# EAGLE design Layout_Stecksockel (EAGLE 7.2.0)
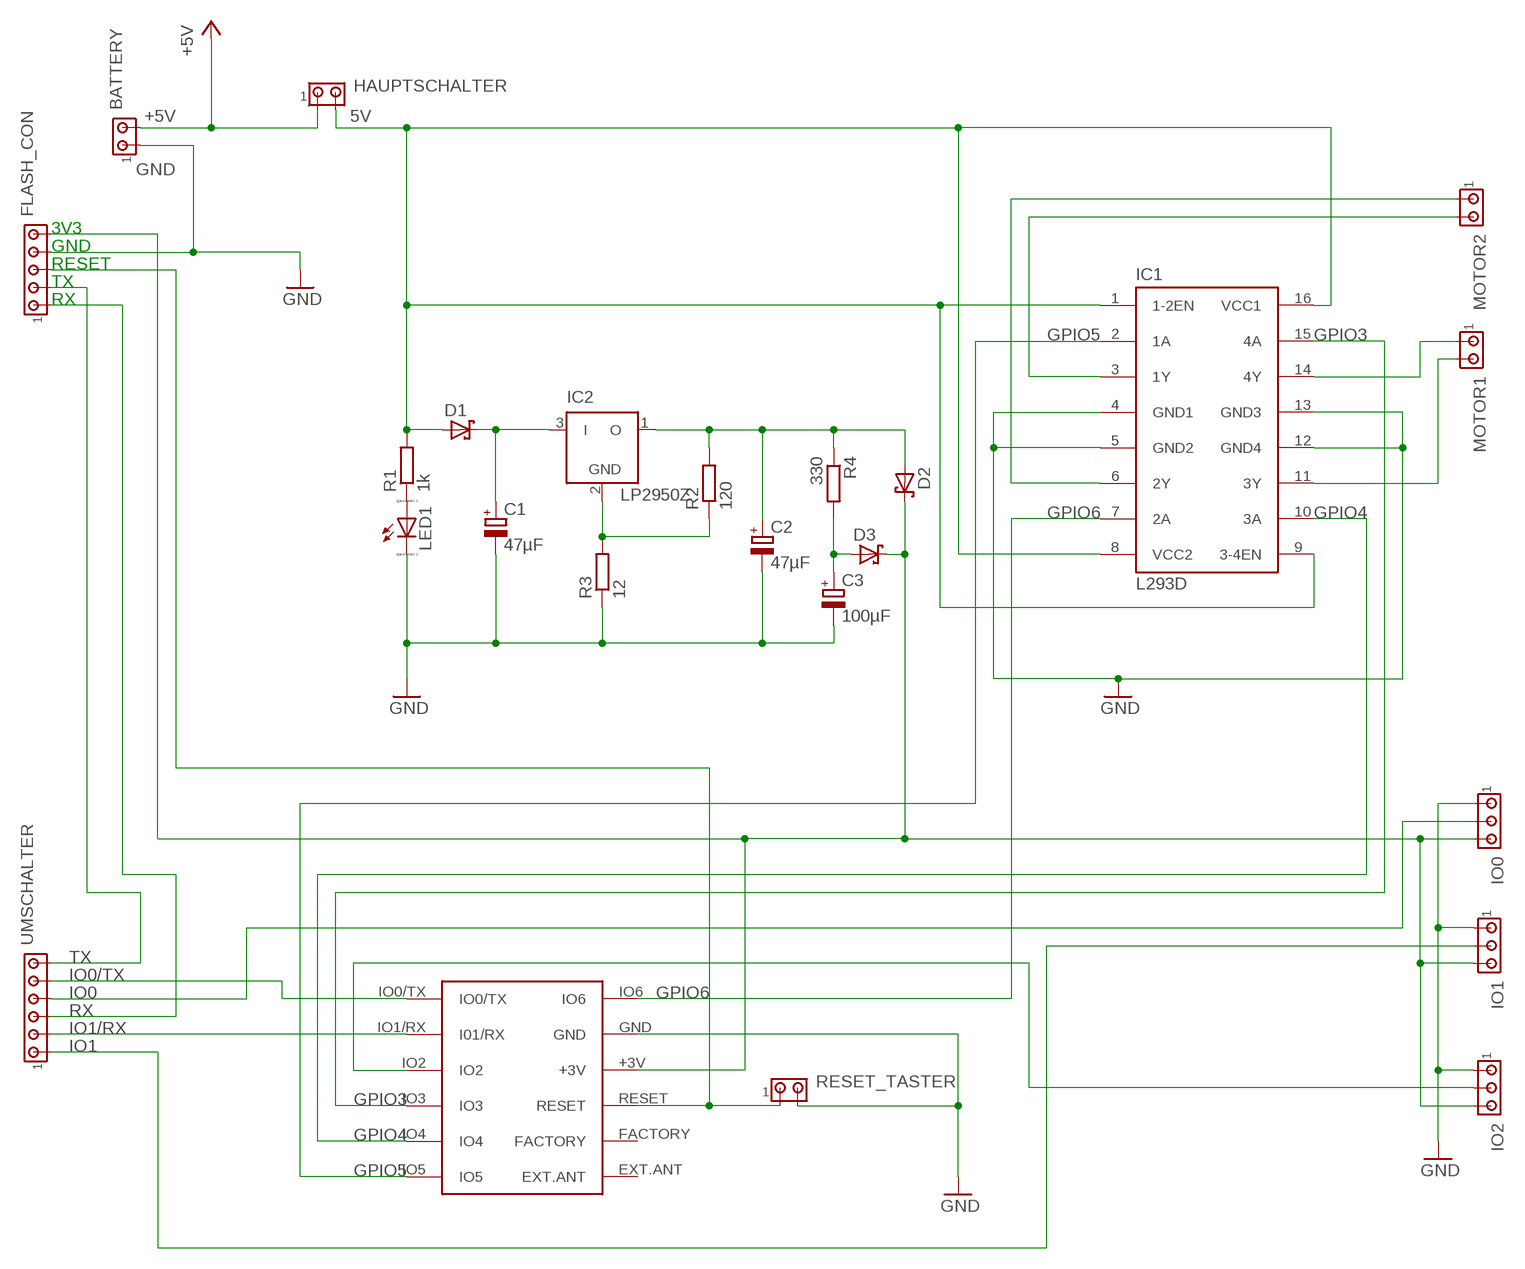
[diagram p0: schematic, sheet 1]

## Parts
BATTERY  MTA02-100  [10X02MTA]
C1  47µF  CPOL-EUE2,5-6E  [E2,5-6E]
C2  47µF  CPOL-EUE2,5-6E  [E2,5-6E]
C3  100µF  CPOL-EUE2,5-6E  [E2,5-6E]
D1  SCHOTTKY-DIODEDO35-7  [DO35-7]
D2  SCHOTTKY-DIODEDO35-7  [DO35-7]
D3  SCHOTTKY-DIODEDO35-7  [DO35-7]
FLASH_CON  MTA05-100  [10X05MTA]
HAUPTSCHALTER  MTA02-100  [10X02MTA]
IC1  L293D  [DIL16]
IC2  LP2950Z  [TO92]
IO0  MTA03-100  [10X03MTA]
IO1  MTA03-100  [10X03MTA]
IO2  MTA03-100  [10X03MTA]
LED1  LED_ELD260  [LED_LD260]
MOTOR1  MTA02-100  [10X02MTA]
MOTOR2  MTA02-100  [10X02MTA]
R1  1k  R-EU_0207/10  [0207/10]
R2  120  R-EU_0207/10  [0207/10]
R3  12  R-EU_0207/10  [0207/10]
R4  330  R-EU_0207/10  [0207/10]
RESET_TASTER  MTA02-100  [10X02MTA]
U$1  RFDUINO  [RFDUINO]
UMSCHALTER  MTA06-100  [10X06MTA]

## Nets
5V: D1.A HAUPTSCHALTER.2 IC1.1(1-2EN) IC1.8(VCC2) IC1.9(3-4EN) IC1.16(VCC1) R1.2
+3V: D2.C D3.C FLASH_CON.5 IO0.3 IO1.3 IO2.3 U$1.+3V
+5V: BATTERY.2 HAUPTSCHALTER.1
GND: BATTERY.1 C1.- C2.- C3.- FLASH_CON.4 IC1.4(GND1) IC1.5(GND2) IC1.12(GND4) IC1.13(GND3) IO0.1 IO1.1 IO2.1 LED1.K(C) R3.1 RESET_TASTER.2 U$1.GND
GPIO3: IC1.15(4A) U$1.IO3
GPIO4: IC1.10(3A) U$1.IO4
GPIO5: IC1.2(1A) U$1.IO5
GPIO6: IC1.7(2A) U$1.IO6
IO0: IO0.2 UMSCHALTER.4
IO0/TX: U$1.IO0/TX UMSCHALTER.5
IO1: IO1.2 UMSCHALTER.1
IO1/RX: U$1.IO1/RX(I01/RX) UMSCHALTER.2
N$1: C1.+ D1.C IC2.3(I)
N$2: C3.+ D3.A R4.2
N$5: LED1.A R1.1
N$7: IC1.6(2Y) MOTOR2.1
N$9: IC1.3(1Y) MOTOR2.2
N$10: IC2.2(GND) R2.1 R3.2
N$11: IC1.11(3Y) MOTOR1.2
N$12: IC1.14(4Y) MOTOR1.1
N$15: FLASH_CON.3 RESET_TASTER.1 U$1.RESET
N$17: C2.+ D2.A IC2.1(O) R2.2 R4.1
N$20: IO2.2 U$1.IO2
RX: FLASH_CON.1 UMSCHALTER.3
TX: FLASH_CON.2 UMSCHALTER.6
Unconnected: U$1.EXT.ANT U$1.FACTORY

## Notes on the sheet
- 3V3
- GND
- RESET
- TX
- RX

## Library data of the parts
BATTERY HAUPTSCHALTER MOTOR1 MOTOR2 RESET_TASTER = con-amp:MTA02-100: AMP connector
C1-C3 = rcl:CPOL-EU: POLARIZED CAPACITOR, European symbol
D1-D3 = diode:SCHOTTKY-DIODE: Schottky Diode
FLASH_CON = con-amp:MTA05-100: AMP connector
IC1 = st-microelectronics:L293D: PUSH-PULL 4 CHANNEL DRIVER; MPN: L293D; OC_FARNELL: 9589619; OC_NEWARK: 56P8249
IC2 = linear:LP2950: 100 mA, Low Power Low Dropout Voltage Regulator Source: http://www.onsemi.com/pub/Collateral/LP2950-D.PDF
IO0 IO1 IO2 = con-amp:MTA03-100: AMP connector
LED1 = eagle-ltspice:LED_E: LED Source: http://www.osram.convergy.de Source: www.luxeon.com Source: www.kingbright.com; SPICEMODEL: NONE; SPICEPREFIX: D; SPICETYPE: diode
R1 = resistor:R-EU_: RESISTOR, European symbol
R2-R4 = rcl:R-EU_: RESISTOR, European symbol
U$1 = RFDuino:RFDUINO
UMSCHALTER = con-amp:MTA06-100: AMP connector Connection corrected 2014-09-19

## Net classes
0 default: clearance 0.205 mm

## Board
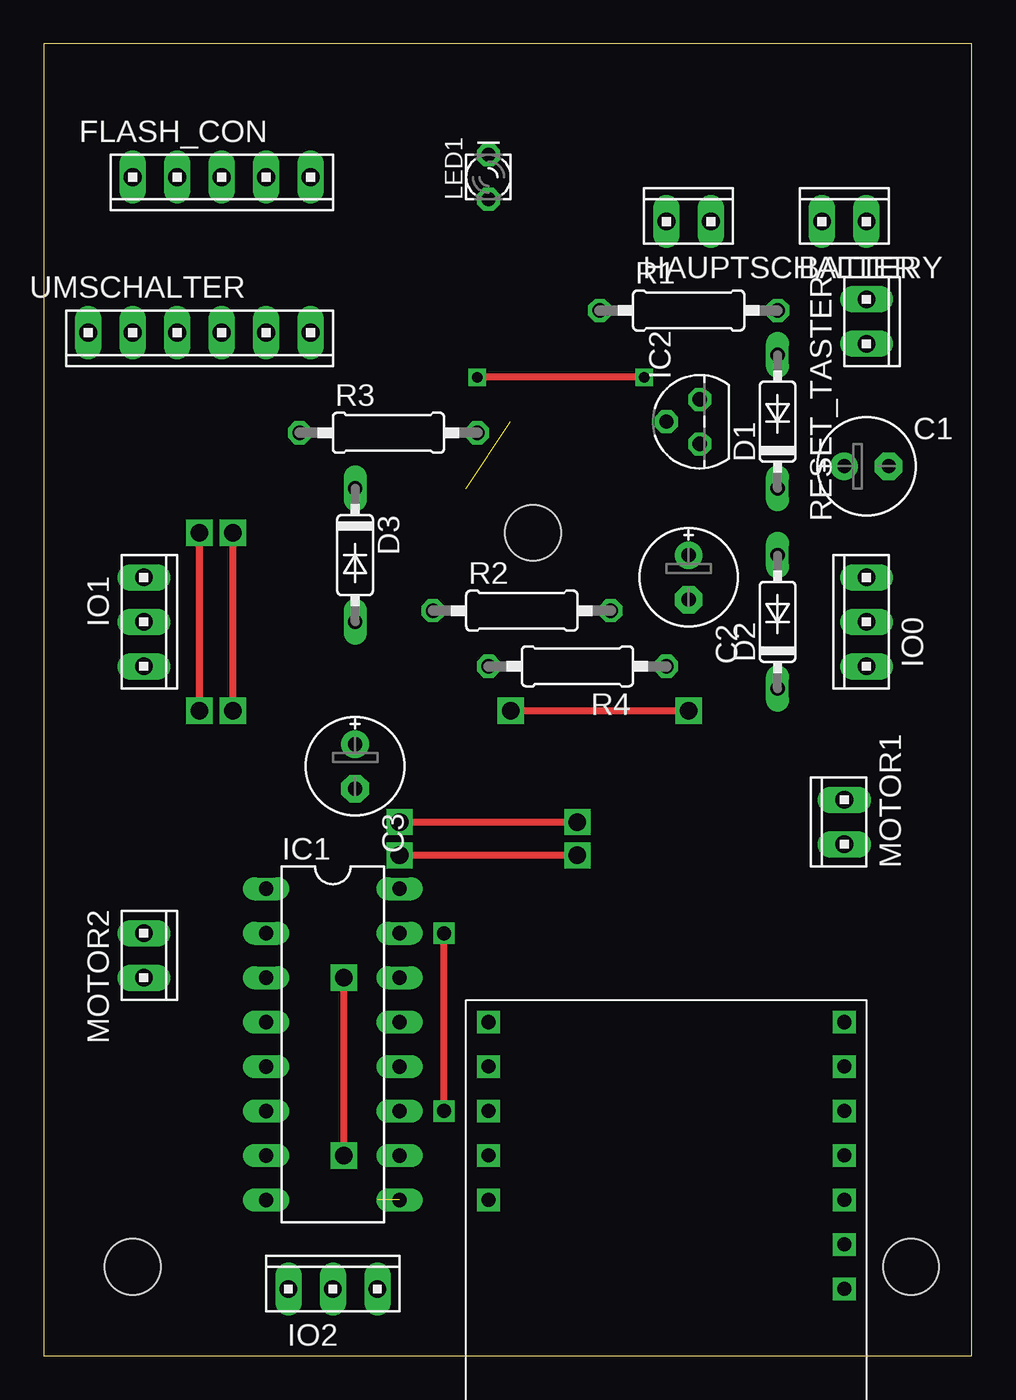
[diagram p1: board, top side]
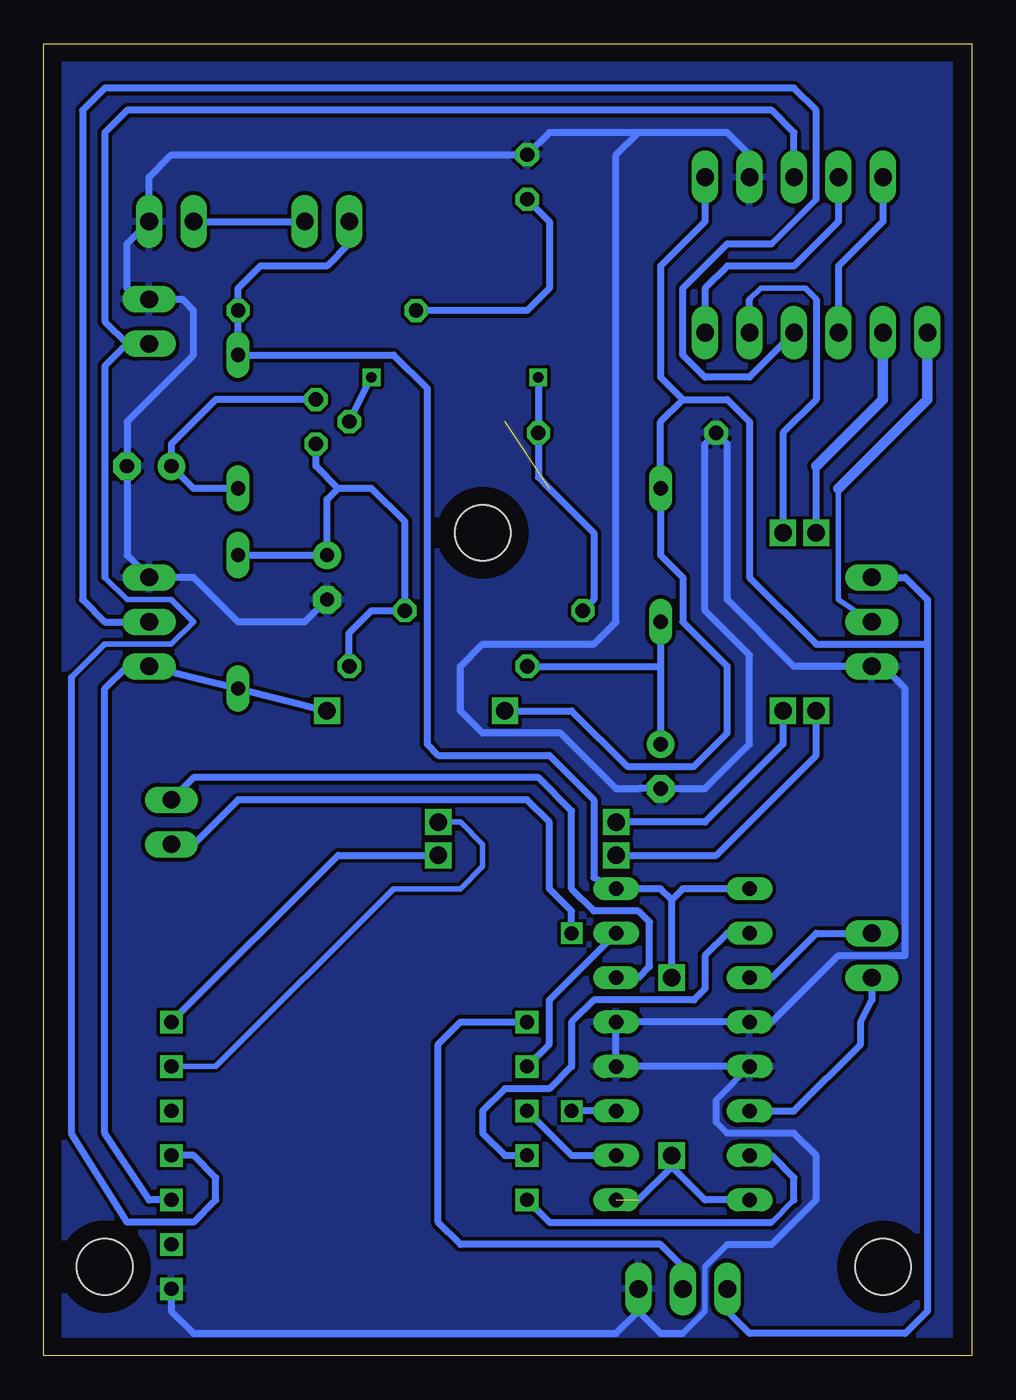
[diagram p2: board, bottom side, seen from below]

Size 53.01 x 74.92 mm. Coordinates in mm from the lower left corner, seen from the top.
Outline: 0,0 53.01,0 53.01,74.92 0,74.92 0,0
Copper layers (1*16): Top 0.035mm / dielectric 1.5mm / Bottom 0.035mm
Design rules "default": minimum track width 10mil, minimum drill 24mil, track to track 8mil, track to pad 8mil, pad to pad 8mil, via to via 8mil, smd to smd 8mil, copper to edge 40mil, drill to drill 8mil, minimum pad ring 10mil, minimum via ring 8mil, stop-mask expansion 4mil, vias tented up to drill 0mil, thermal gap 10mil
Holes 3.2 mm at 5.08,5.08 49.53,5.08 27.94,46.99

### Footprints (pad centres in the part's own frame; a part is rotated, then mirrored left to right if it is on the bottom)
10X02MTA = drill 1.016 long: 1 1.27,0; 2 -1.27,0
E2,5-6E = drill 0.813 pad 1.575: + -1.27,0 | drill 0.813 pad 1.575 octagon: - 1.27,0
DO35-7 = drill 0.813 long: A 3.81,0; C -3.81,0
10X05MTA = drill 1.016 long: 1 5.08,0; 2 2.54,0; 3 0,0; 4 -2.54,0; 5 -5.08,0
DIL16 = drill 0.813 long: 1 -8.89,-3.81; 2 -6.35,-3.81; 3 -3.81,-3.81; 4 -1.27,-3.81; 5 1.27,-3.81; 6 3.81,-3.81; 7 6.35,-3.81; 8 8.89,-3.81; 9 8.89,3.81; 10 6.35,3.81; 11 3.81,3.81; 12 1.27,3.81; 13 -1.27,3.81; 14 -3.81,3.81; 15 -6.35,3.81; 16 -8.89,3.81
TO92 = drill 0.813 octagon: 1 -1.27,0; 2 0,1.905; 3 1.27,0
10X03MTA = drill 1.016 long: 1 2.54,0; 2 0,0; 3 -2.54,0
LED_LD260 = drill 0.813 octagon: A -1.27,0; K 1.27,0
0207/10 = drill 0.813 octagon: 1 -5.08,0; 2 5.08,0
RFDUINO = drill 0.8 square: +3V 1.27,11.43; EXT.ANT 1.27,13.97; FACTORY 1.27,6.35; GND 1.27,16.51; IO0/TX 1.27,3.81; IO1/RX 1.27,1.27; IO2 21.59,1.27; IO3 21.59,3.81; IO4 21.59,6.35; IO5 21.59,8.89; IO6 21.59,11.43; RESET 1.27,8.89
10X06MTA = drill 1.016 long: 1 6.35,0; 2 3.81,0; 3 1.27,0; 4 -1.27,0; 5 -3.81,0; 6 -6.35,0

### Placement (x,y rotation side)
BATTERY  45.72,64.77 0 top
C1  46.99,50.8 0 top
C2  36.83,44.45 270 top
C3  17.78,33.66 270 top
D1  41.91,53.34 90 top
D2  41.91,41.91 90 top
D3  17.78,45.72 270 top
FLASH_CON  10.16,67.31 180 top
HAUPTSCHALTER  36.83,64.77 0 top
IC1  16.51,17.78 270 top
IC2  37.47,53.34 90 top
IO0  46.99,41.91 90 top
IO1  5.71,41.91 270 top
IO2  16.51,3.81 0 top
LED1  25.4,67.31 90 top
MOTOR1  45.72,30.48 90 top
MOTOR2  5.71,22.86 270 top
R1  36.83,59.69 0 top
R2  27.3,42.55 0 top
R3  19.68,52.7 0 top
R4  30.48,39.37 180 top
RESET_TASTER  46.99,59.05 270 top
U$1  46.99,20.32 180 top
UMSCHALTER  8.89,58.42 180 top

### Tracks (layer width: path | path; a pad name or v marks a point on that pad's centre or on a via)
5V  (via drill 1)  (1 unrouted)
  Top 0.406: v17.14,11.43 v17.14,21.59
  Bottom 0.406: IC1.8 15.24,8.89 17.14,10.79 | 17.14,10.79 v17.14,11.43 | v17.14,21.59 17.14,26.04 | 17.14,26.04 17.78,26.67 IC1.16 21.59,27.3 21.59,31.75 24.13,34.29 30.48,34.29 31.11,34.92 31.11,55.24 33.02,57.15 D1.A R1.2 41.91,60.96 40.64,62.23 36.83,62.23 35.56,63.5 HAUPTSCHALTER.2 | 17.14,26.04 16.51,26.67 IC1.1 | 17.14,10.79 19.05,8.89
+3V  (via drill 1)
  Top 0.406: v36.83,36.83 v26.67,36.83
  Bottom 0.406: U$1.+3V 46.99,8.89 49.53,12.7 49.53,38.1 48.26,39.37 IO0.3 D2.C v36.83,36.83 | IO1.3 3.81,44.45 2.54,43.18 2.54,40.64 | 2.54,40.64 2.54,2.54 3.81,1.27 12.7,1.27 13.97,2.54 IO2.3 | FLASH_CON.5 15.24,64.77 17.78,62.23 17.78,55.88 16.51,54.61 | 16.51,54.61 13.97,54.61 12.7,53.34 12.7,44.45 8.89,40.64 2.54,40.64 | v26.67,36.83 22.86,36.83 19.68,33.66 15.88,33.66 13.97,35.56 13.97,39.37 16.51,41.91 16.51,44.45 17.78,45.72 D3.C 17.78,53.34 16.51,54.61
+5V
  Bottom 0.406: BATTERY.2 HAUPTSCHALTER.1
GND
  Bottom 0.305: 16.51,1.27 15.24,2.54 15.24,5.08 13.97,6.35 | 13.97,12.7 14.61,13.34 | 14.61,14.61 IC1.5
  Bottom 0.406: FLASH_CON.4 12.7,68.58 13.97,69.85 19.05,69.85 | 19.05,69.85 24.13,69.85 LED1.K 45.72,68.58 46.99,67.31 BATTERY.1 48.26,63.5 48.26,60.96 RESET_TASTER.2 45.09,60.33 44.45,59.69 44.45,57.15 48.26,53.34 C1.- 48.26,45.72 IO0.1 44.45,44.45 41.91,41.91 38.1,41.91 C2.- | IC1.5 IC1.12 IC1.13 IC1.4 11.43,19.05 7.62,22.86 3.81,22.86 3.81,38.1 5.08,39.37 IO1.1 10.16,39.37 13.97,43.18 13.97,52.07 R3.1 15.24,52.07 15.24,42.55 12.7,40.01 12.7,34.92 15.24,32.38 C3.- 19.05,32.38 20.32,32.38 23.5,35.56 27.94,35.56 29.21,36.83 29.21,39.37 27.94,40.64 21.59,40.64 20.32,41.91 20.32,68.58 19.05,69.85 | IO2.1 19.05,2.54 | 19.05,2.54 17.78,1.27 16.51,1.27 | 13.97,6.35 11.43,6.35 8.89,8.89 8.89,11.43 10.16,12.7 13.97,12.7 | 14.61,13.34 14.61,14.61 | U$1.GND 45.72,2.54 44.45,1.27 20.32,1.27 19.05,2.54
  pour Bottom (isolate 0.254): 1.27,74.93 53.34,74.93 53.34,0 1.27,0
GPIO3
  Bottom 0.406: U$1.IO3 24.13,17.78 24.13,20.32 IC1.15
GPIO4
  Bottom 0.406: U$1.IO4 22.86,11.43 IC1.10
GPIO5
  Bottom 0.406: U$1.IO5 26.67,11.43 27.94,12.7 27.94,13.97 26.67,15.24 24.13,15.24 22.86,16.51 22.86,19.05 21.59,20.32 15.88,20.32 15.24,20.95 15.24,22.86 13.97,24.13 IC1.2
GPIO6
  Bottom 0.305: 11.43,7.62 10.16,8.89
  Bottom 0.406: U$1.IO6 24.13,7.62 11.43,7.62 | 10.16,8.89 10.16,10.16 11.43,11.43 IC1.7
IO0
  Bottom 0.305: 11.43,63.5 8.89,66.04
  Bottom 0.406: UMSCHALTER.4 12.7,55.88 15.24,55.88 16.51,57.15 16.51,60.96 13.97,63.5 11.43,63.5 | 8.89,66.04 8.89,71.12 10.16,72.39 49.53,72.39 50.8,71.12 50.8,43.18 49.53,41.91 IO0.2
IO0/TX  (via drill 1)
  Top 0.406: v10.79,46.99 v10.79,36.83 | v20.32,30.48 v30.48,30.48
  Bottom 0.305: 12.7,60.33 12.06,60.96 9.53,60.96 8.89,60.33 | v30.48,30.48 29.21,30.48 27.94,29.21 27.94,27.94 29.21,26.67 33.02,26.67 43.18,16.51 U$1.IO0/TX
  Bottom 0.406: UMSCHALTER.5 12.7,60.33 | 8.89,60.33 8.89,54.61 10.79,52.7 v10.79,46.99 | v10.79,36.83 10.79,34.92 15.24,30.48 v20.32,30.48
IO1
  Bottom 0.305: 7.62,49.53 7.62,43.18 IO1.2
  Bottom 0.61: 7.62,49.53 2.54,54.61 UMSCHALTER.1
IO1/RX  (via drill 1)
  Top 0.406: v30.48,28.57 v20.32,28.57 | v8.89,36.83 v8.89,46.99
  Bottom 0.406: U$1.IO1/RX 36.2,28.57 v30.48,28.57 | v20.32,28.57 14.61,28.57 8.89,34.29 v8.89,36.83 | v8.89,46.99 8.89,50.8
  Bottom 0.61: 8.89,50.8 5.08,54.61 UMSCHALTER.2
N$1
  Bottom 0.406: D1.C 44.45,49.53 C1.+ 45.72,52.07 43.18,54.61 IC2.3
N$2
  Bottom 0.406: D3.A 17.78,39.37 | 17.78,39.37 C3.+ | R4.2 17.78,39.37
N$5
  Bottom 0.406: LED1.A 24.13,64.77 24.13,60.96 25.4,59.69 R1.1
N$7
  Bottom 0.406: MOTOR2.1 5.71,20.32 6.35,19.05 6.35,17.78 10.16,13.97 IC1.6
N$8
  pour Bottom: 1.27,74.93 53.34,74.93 53.34,0 1.27,0
N$9
  Bottom 0.406: IC1.3 11.43,21.59 8.89,24.13 MOTOR2.2
N$10  (via drill 0.6)  (1 unrouted)
  Top 0.406: v34.29,55.88 v24.77,55.88
  Bottom 0.406: R2.1 21.59,43.18 21.59,46.99 24.13,49.53 24.77,50.16 R3.2 v24.77,55.88 | IC2.2 v34.29,55.88
N$11  (via drill 0.8)
  Top 0.406: v22.86,13.97 v22.86,24.13
  Bottom 0.406: IC1.11 v22.86,13.97 | v22.86,24.13 22.86,25.4 24.13,26.67 24.13,30.48 25.4,31.75 41.91,31.75 44.45,29.21 MOTOR1.2
N$12
  Bottom 0.406: IC1.14 19.05,21.59 18.41,22.23 18.41,24.77 19.05,25.4 21.59,25.4 22.86,26.67 22.86,31.11 24.77,33.02 44.45,33.02 MOTOR1.1
N$15
  Bottom 0.305: 49.53,44.45 48.26,43.18 45.72,43.18 44.45,41.91 45.72,40.64 49.53,40.64 51.44,38.73
  Bottom 0.406: FLASH_CON.3 10.16,69.85 11.43,71.12 48.26,71.12 49.53,69.85 49.53,59.05 48.26,57.78 | RESET_TASTER.1 48.26,57.78 | 48.26,57.78 49.53,56.52 49.53,44.45 | 51.44,38.73 51.44,12.7 48.26,7.62 44.45,7.62 43.18,8.89 43.18,10.16 44.45,11.43 U$1.RESET
N$17
  Bottom 0.406: D2.A C2.+ 36.83,48.9 36.2,49.53 | 36.2,49.53 34.29,49.53 32.38,47.62 R2.2 34.29,42.55 35.56,41.27 R4.1 | 36.2,49.53 37.47,50.8 IC2.1
N$20
  Bottom 0.406: IO2.2 16.51,5.08 17.78,6.35 29.21,6.35 30.48,7.62 30.48,17.78 29.21,19.05 U$1.IO2
RX
  Bottom 0.406: FLASH_CON.1 5.08,64.77 7.62,62.23 UMSCHALTER.3
TX
  Bottom 0.406: FLASH_CON.2 7.62,64.77 10.16,62.23 13.97,62.23 15.24,60.96 UMSCHALTER.6